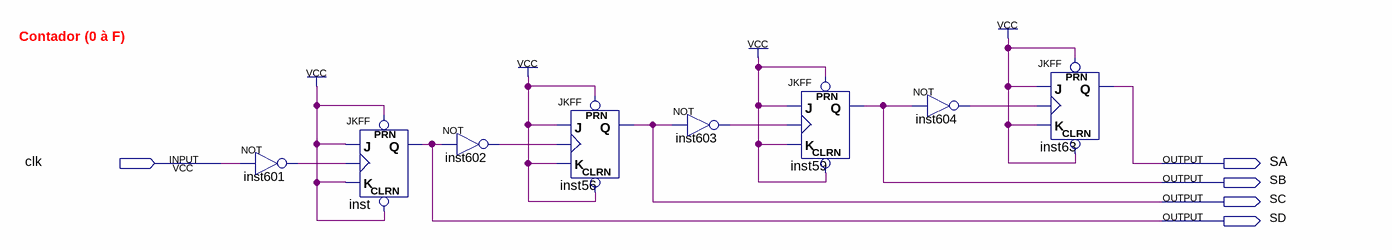
[diagram p0: schematic sheet]
// Quartus schematic Contador.bdf as structural Verilog: 8 symbols, 5 pins
module Contador (
  input  clk,
  output SA,
  output SB,
  output SC,
  output SD
);

  wire inst601_out, inst602_out, inst603_out, inst604_out;

  not inst601 (inst601_out, clk);
  JKFF inst (.PRN(1'b1), .CLRN(1'b1), .K(1'b1), .J(1'b1), .CLK(inst601_out), .Q(SD));
  not inst602 (inst602_out, SD);
  JKFF inst56 (.PRN(1'b1), .CLRN(1'b1), .K(1'b1), .J(1'b1), .CLK(inst602_out), .Q(SC));
  not inst603 (inst603_out, SC);
  JKFF inst59 (.PRN(1'b1), .CLRN(1'b1), .K(1'b1), .J(1'b1), .CLK(inst603_out), .Q(SB));
  not inst604 (inst604_out, SB);
  JKFF inst63 (.PRN(1'b1), .CLRN(1'b1), .K(1'b1), .J(1'b1), .CLK(inst604_out), .Q(SA));

  // Notes on the sheet:
  //   Contador (0 à F)
endmodule
